# EAGLE schematic HighVoltageMeasurementModule_1000V_multimax (EAGLE 9.6.2)

## Sheet 1 of 2
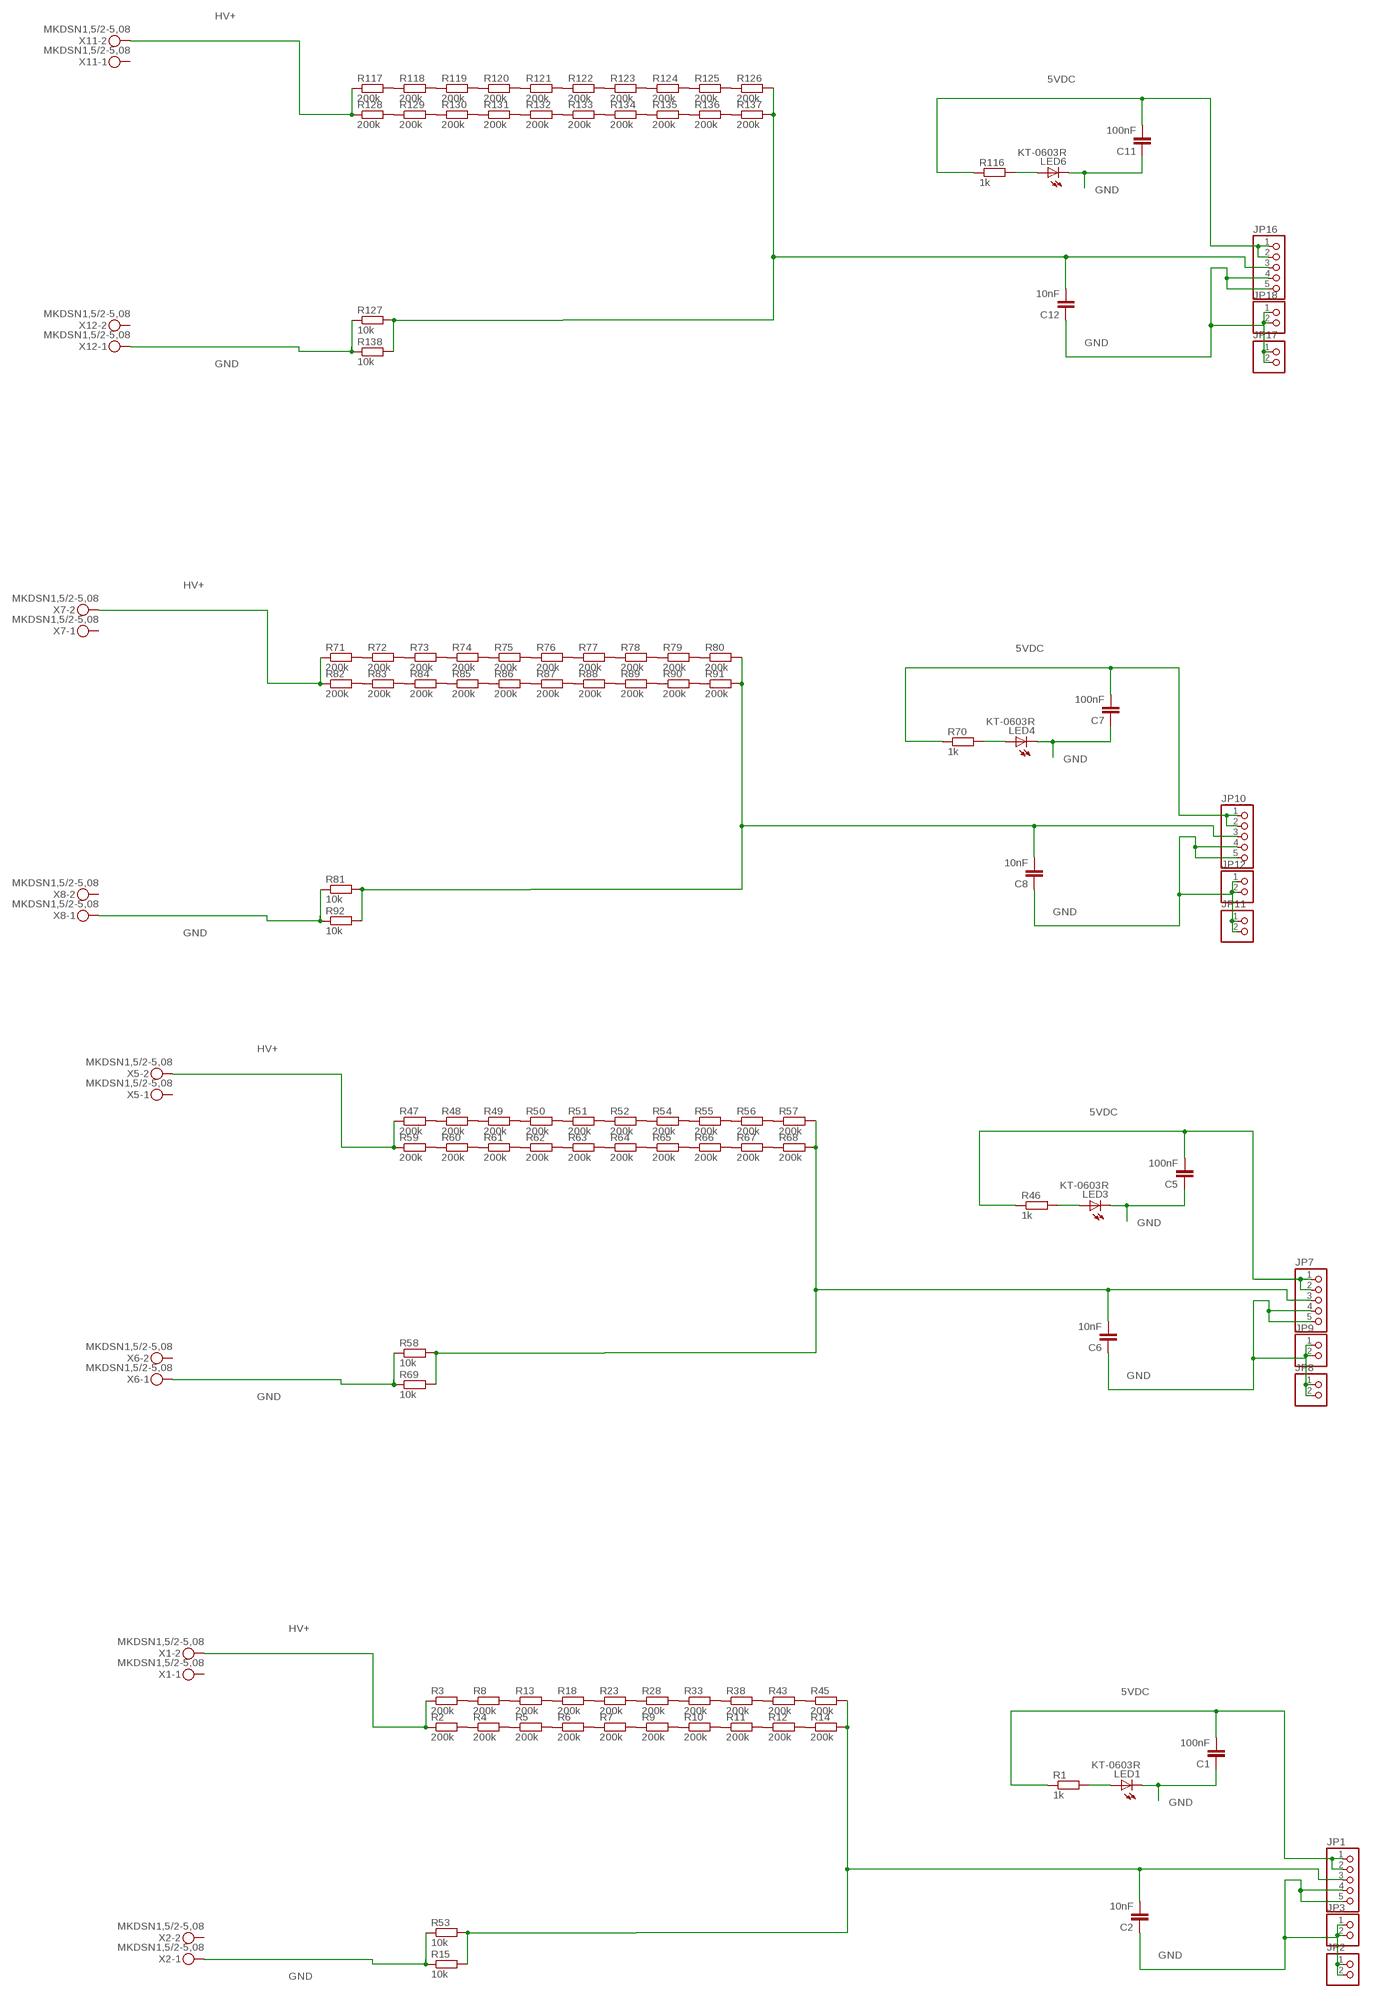
[diagram p0: schematic, sheet 1, part 1 of 3]
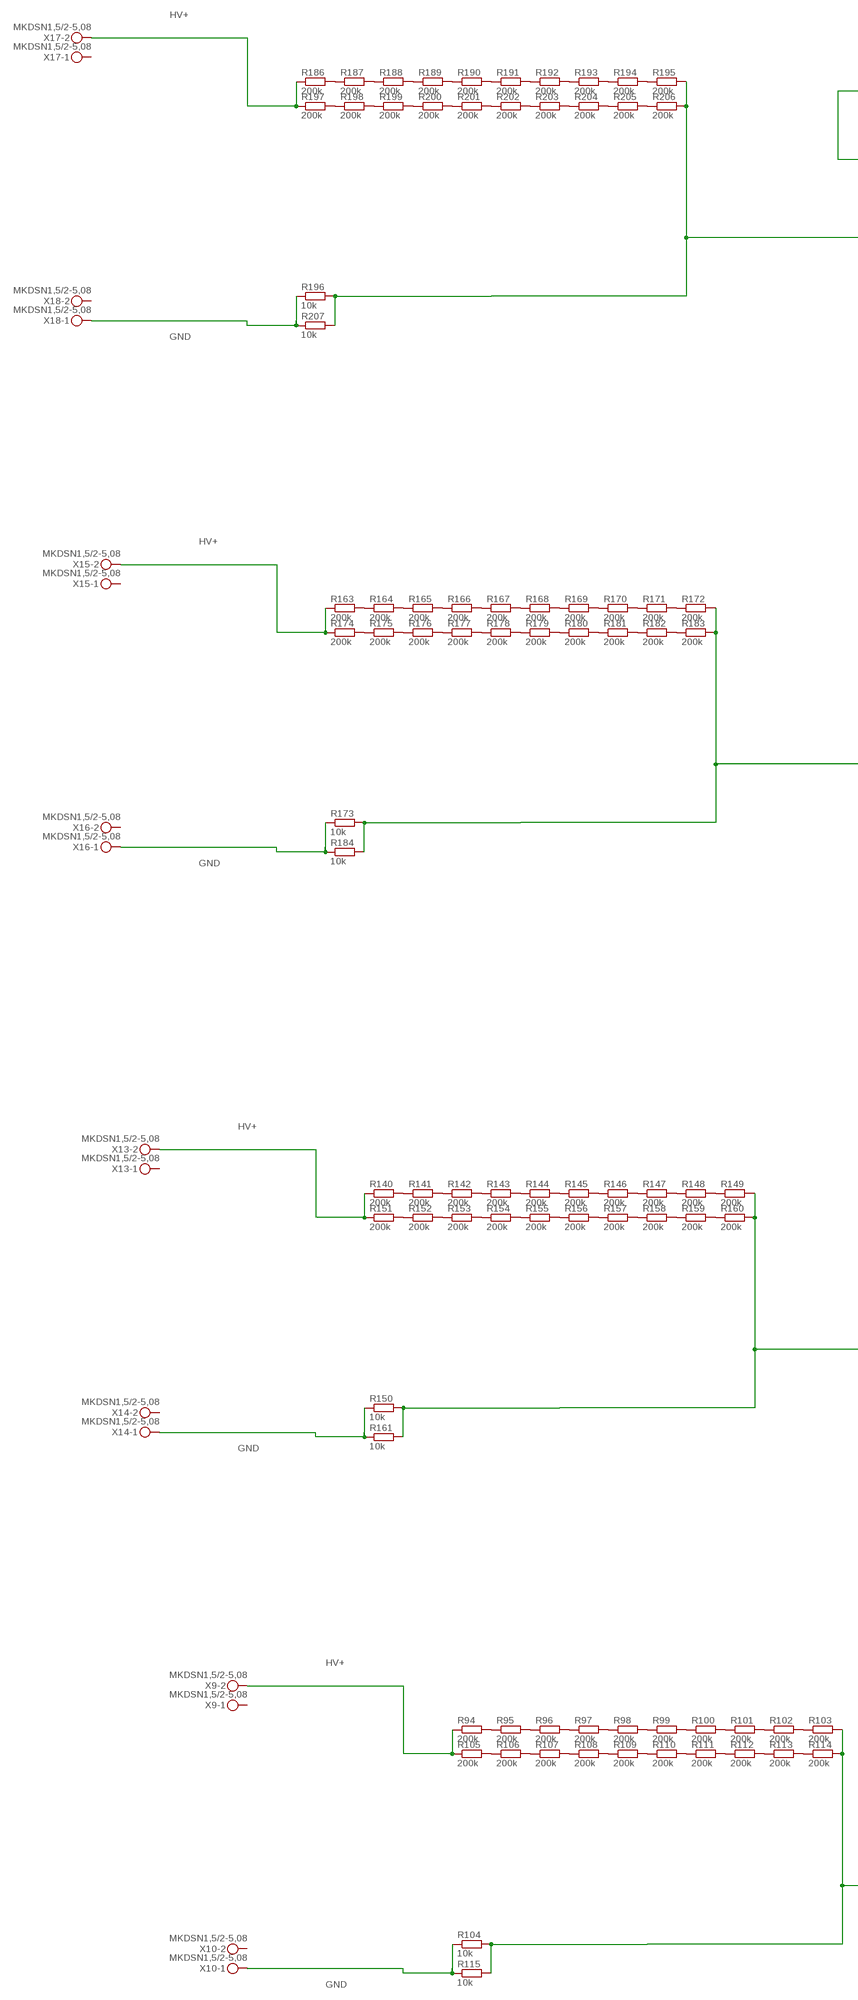
[diagram p1: schematic, sheet 1, part 2 of 3]
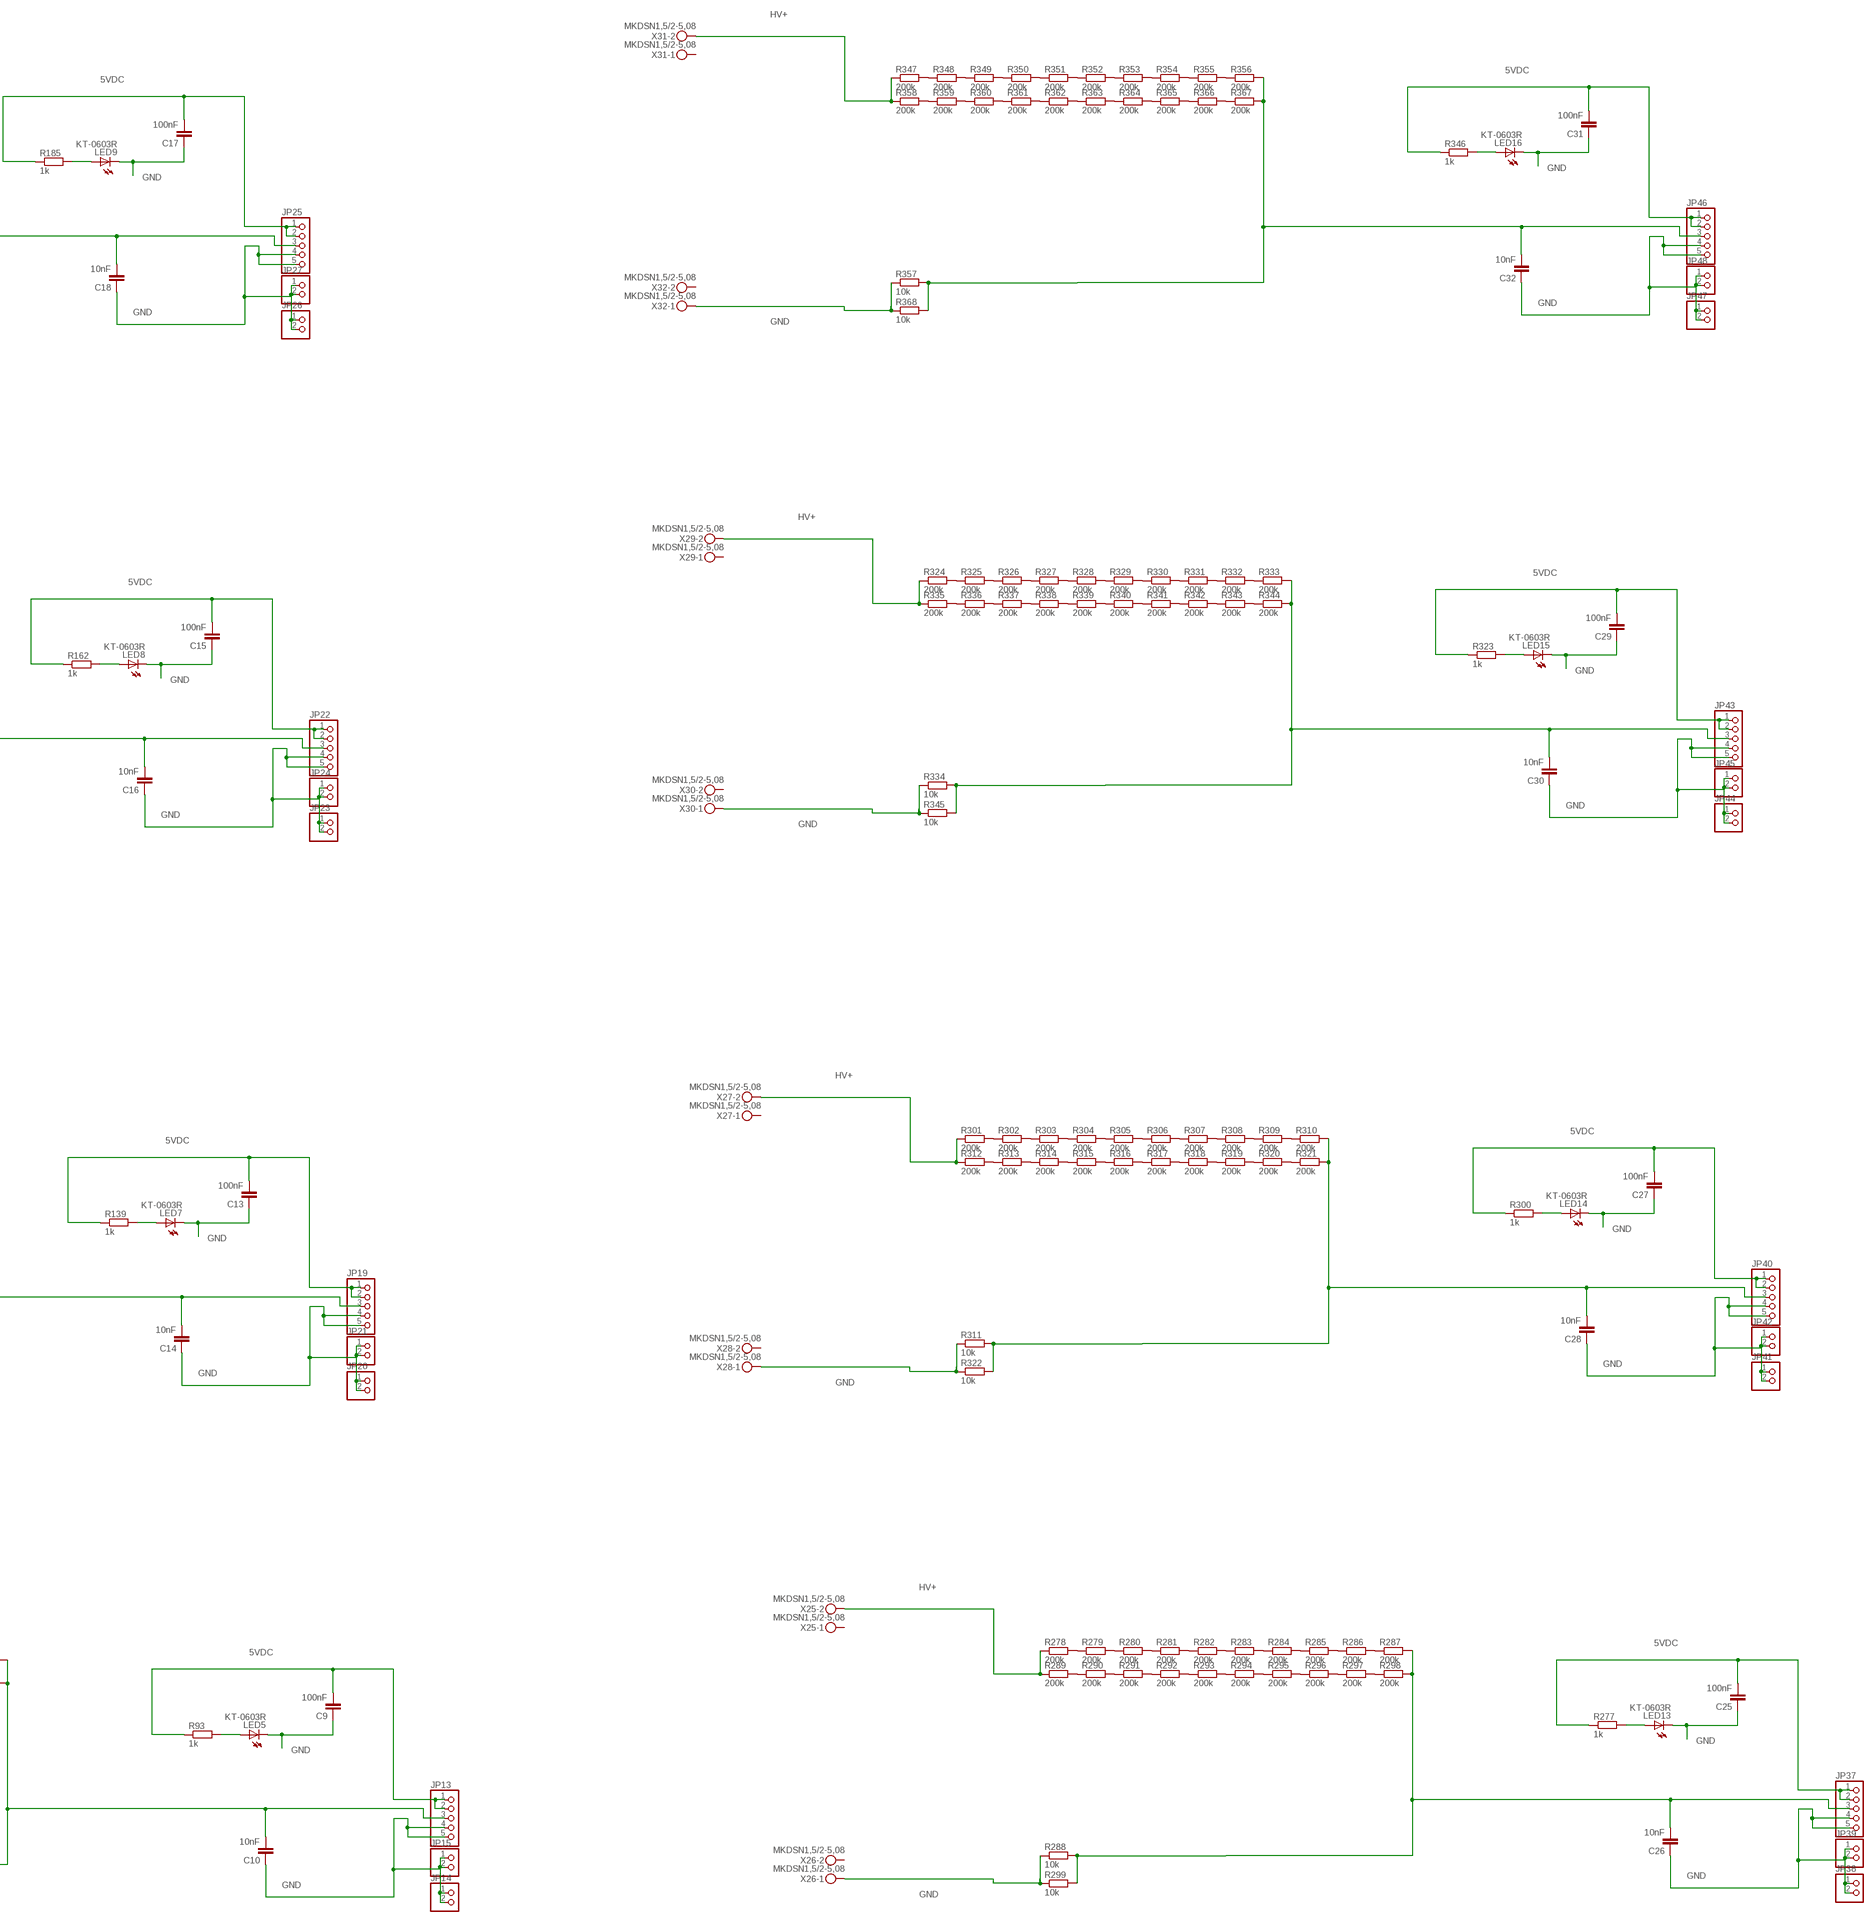
[diagram p2: schematic, sheet 1, part 3 of 3]

### Parts
C1  100nF  C-EUC0805  [C0805]
C2  10nF  C-EUC0805  [C0805]
C5  100nF  C-EUC0805  [C0805]
C6  10nF  C-EUC0805  [C0805]
C7  100nF  C-EUC0805  [C0805]
C8  10nF  C-EUC0805  [C0805]
C9  100nF  C-EUC0805  [C0805]
C10  10nF  C-EUC0805  [C0805]
C11  100nF  C-EUC0805  [C0805]
C12  10nF  C-EUC0805  [C0805]
C13  100nF  C-EUC0805  [C0805]
C14  10nF  C-EUC0805  [C0805]
C15  100nF  C-EUC0805  [C0805]
C16  10nF  C-EUC0805  [C0805]
C17  100nF  C-EUC0805  [C0805]
C18  10nF  C-EUC0805  [C0805]
C25  100nF  C-EUC0805  [C0805]
C26  10nF  C-EUC0805  [C0805]
C27  100nF  C-EUC0805  [C0805]
C28  10nF  C-EUC0805  [C0805]
C29  100nF  C-EUC0805  [C0805]
C30  10nF  C-EUC0805  [C0805]
C31  100nF  C-EUC0805  [C0805]
C32  10nF  C-EUC0805  [C0805]
JP1  PINHD-1X5  [1X05]
JP2  PINHD-1X2  [1X02]
JP3  PINHD-1X2  [1X02]
JP7  PINHD-1X5  [1X05]
JP8  PINHD-1X2  [1X02]
JP9  PINHD-1X2  [1X02]
JP10  PINHD-1X5  [1X05]
JP11  PINHD-1X2  [1X02]
JP12  PINHD-1X2  [1X02]
JP13  PINHD-1X5  [1X05]
JP14  PINHD-1X2  [1X02]
JP15  PINHD-1X2  [1X02]
JP16  PINHD-1X5  [1X05]
JP17  PINHD-1X2  [1X02]
JP18  PINHD-1X2  [1X02]
JP19  PINHD-1X5  [1X05]
JP20  PINHD-1X2  [1X02]
JP21  PINHD-1X2  [1X02]
JP22  PINHD-1X5  [1X05]
JP23  PINHD-1X2  [1X02]
JP24  PINHD-1X2  [1X02]
JP25  PINHD-1X5  [1X05]
JP26  PINHD-1X2  [1X02]
JP27  PINHD-1X2  [1X02]
JP37  PINHD-1X5  [1X05]
JP38  PINHD-1X2  [1X02]
JP39  PINHD-1X2  [1X02]
JP40  PINHD-1X5  [1X05]
JP41  PINHD-1X2  [1X02]
JP42  PINHD-1X2  [1X02]
JP43  PINHD-1X5  [1X05]
JP44  PINHD-1X2  [1X02]
JP45  PINHD-1X2  [1X02]
JP46  PINHD-1X5  [1X05]
JP47  PINHD-1X2  [1X02]
JP48  PINHD-1X2  [1X02]
LED1  KT-0603R  LEDCHIPLED_0603  [CHIPLED_0603]
LED3  KT-0603R  LEDCHIPLED_0603  [CHIPLED_0603]
LED4  KT-0603R  LEDCHIPLED_0603  [CHIPLED_0603]
LED5  KT-0603R  LEDCHIPLED_0603  [CHIPLED_0603]
LED6  KT-0603R  LEDCHIPLED_0603  [CHIPLED_0603]
LED7  KT-0603R  LEDCHIPLED_0603  [CHIPLED_0603]
LED8  KT-0603R  LEDCHIPLED_0603  [CHIPLED_0603]
LED9  KT-0603R  LEDCHIPLED_0603  [CHIPLED_0603]
LED13  KT-0603R  LEDCHIPLED_0603  [CHIPLED_0603]
LED14  KT-0603R  LEDCHIPLED_0603  [CHIPLED_0603]
LED15  KT-0603R  LEDCHIPLED_0603  [CHIPLED_0603]
LED16  KT-0603R  LEDCHIPLED_0603  [CHIPLED_0603]
R1  1k  R-EU_R0805  [R0805]
R2  200k  R-EU_R0805  [R0805]
R3  200k  R-EU_R0805  [R0805]
R4  200k  R-EU_R0805  [R0805]
R5  200k  R-EU_R0805  [R0805]
R6  200k  R-EU_R0805  [R0805]
R7  200k  R-EU_R0805  [R0805]
R8  200k  R-EU_R0805  [R0805]
R9  200k  R-EU_R0805  [R0805]
R10  200k  R-EU_R0805  [R0805]
R11  200k  R-EU_R0805  [R0805]
R12  200k  R-EU_R0805  [R0805]
R13  200k  R-EU_R0805  [R0805]
R14  200k  R-EU_R0805  [R0805]
R15  10k  R-EU_R0805  [R0805]
R18  200k  R-EU_R0805  [R0805]
R23  200k  R-EU_R0805  [R0805]
R28  200k  R-EU_R0805  [R0805]
R33  200k  R-EU_R0805  [R0805]
R38  200k  R-EU_R0805  [R0805]
R43  200k  R-EU_R0805  [R0805]
R45  200k  R-EU_R0805  [R0805]
R46  1k  R-EU_R0805  [R0805]
R47  200k  R-EU_R0805  [R0805]
R48  200k  R-EU_R0805  [R0805]
R49  200k  R-EU_R0805  [R0805]
R50  200k  R-EU_R0805  [R0805]
R51  200k  R-EU_R0805  [R0805]
R52  200k  R-EU_R0805  [R0805]
R53  10k  R-EU_R0805  [R0805]
R54  200k  R-EU_R0805  [R0805]
R55  200k  R-EU_R0805  [R0805]
R56  200k  R-EU_R0805  [R0805]
R57  200k  R-EU_R0805  [R0805]
R58  10k  R-EU_R0805  [R0805]
R59  200k  R-EU_R0805  [R0805]
R60  200k  R-EU_R0805  [R0805]
R61  200k  R-EU_R0805  [R0805]
R62  200k  R-EU_R0805  [R0805]
R63  200k  R-EU_R0805  [R0805]
R64  200k  R-EU_R0805  [R0805]
R65  200k  R-EU_R0805  [R0805]
R66  200k  R-EU_R0805  [R0805]
R67  200k  R-EU_R0805  [R0805]
R68  200k  R-EU_R0805  [R0805]
R69  10k  R-EU_R0805  [R0805]
R70  1k  R-EU_R0805  [R0805]
R71  200k  R-EU_R0805  [R0805]
R72  200k  R-EU_R0805  [R0805]
R73  200k  R-EU_R0805  [R0805]
R74  200k  R-EU_R0805  [R0805]
R75  200k  R-EU_R0805  [R0805]
R76  200k  R-EU_R0805  [R0805]
R77  200k  R-EU_R0805  [R0805]
R78  200k  R-EU_R0805  [R0805]
R79  200k  R-EU_R0805  [R0805]
R80  200k  R-EU_R0805  [R0805]
R81  10k  R-EU_R0805  [R0805]
R82  200k  R-EU_R0805  [R0805]
R83  200k  R-EU_R0805  [R0805]
R84  200k  R-EU_R0805  [R0805]
R85  200k  R-EU_R0805  [R0805]
R86  200k  R-EU_R0805  [R0805]
R87  200k  R-EU_R0805  [R0805]
R88  200k  R-EU_R0805  [R0805]
R89  200k  R-EU_R0805  [R0805]
R90  200k  R-EU_R0805  [R0805]
R91  200k  R-EU_R0805  [R0805]
R92  10k  R-EU_R0805  [R0805]
R93  1k  R-EU_R0805  [R0805]
R94  200k  R-EU_R0805  [R0805]
R95  200k  R-EU_R0805  [R0805]
R96  200k  R-EU_R0805  [R0805]
R97  200k  R-EU_R0805  [R0805]
R98  200k  R-EU_R0805  [R0805]
R99  200k  R-EU_R0805  [R0805]
R100  200k  R-EU_R0805  [R0805]
R101  200k  R-EU_R0805  [R0805]
R102  200k  R-EU_R0805  [R0805]
R103  200k  R-EU_R0805  [R0805]
R104  10k  R-EU_R0805  [R0805]
R105  200k  R-EU_R0805  [R0805]
R106  200k  R-EU_R0805  [R0805]
R107  200k  R-EU_R0805  [R0805]
R108  200k  R-EU_R0805  [R0805]
R109  200k  R-EU_R0805  [R0805]
R110  200k  R-EU_R0805  [R0805]
R111  200k  R-EU_R0805  [R0805]
R112  200k  R-EU_R0805  [R0805]
R113  200k  R-EU_R0805  [R0805]
R114  200k  R-EU_R0805  [R0805]
R115  10k  R-EU_R0805  [R0805]
R116  1k  R-EU_R0805  [R0805]
R117  200k  R-EU_R0805  [R0805]
R118  200k  R-EU_R0805  [R0805]
R119  200k  R-EU_R0805  [R0805]
R120  200k  R-EU_R0805  [R0805]
R121  200k  R-EU_R0805  [R0805]
R122  200k  R-EU_R0805  [R0805]
R123  200k  R-EU_R0805  [R0805]
R124  200k  R-EU_R0805  [R0805]
R125  200k  R-EU_R0805  [R0805]
R126  200k  R-EU_R0805  [R0805]
R127  10k  R-EU_R0805  [R0805]
R128  200k  R-EU_R0805  [R0805]
R129  200k  R-EU_R0805  [R0805]
R130  200k  R-EU_R0805  [R0805]
R131  200k  R-EU_R0805  [R0805]
R132  200k  R-EU_R0805  [R0805]
R133  200k  R-EU_R0805  [R0805]
R134  200k  R-EU_R0805  [R0805]
R135  200k  R-EU_R0805  [R0805]
R136  200k  R-EU_R0805  [R0805]
R137  200k  R-EU_R0805  [R0805]
R138  10k  R-EU_R0805  [R0805]
R139  1k  R-EU_R0805  [R0805]
R140  200k  R-EU_R0805  [R0805]
R141  200k  R-EU_R0805  [R0805]
R142  200k  R-EU_R0805  [R0805]
R143  200k  R-EU_R0805  [R0805]
R144  200k  R-EU_R0805  [R0805]
R145  200k  R-EU_R0805  [R0805]
R146  200k  R-EU_R0805  [R0805]
R147  200k  R-EU_R0805  [R0805]
R148  200k  R-EU_R0805  [R0805]
R149  200k  R-EU_R0805  [R0805]
R150  10k  R-EU_R0805  [R0805]
R151  200k  R-EU_R0805  [R0805]
R152  200k  R-EU_R0805  [R0805]
R153  200k  R-EU_R0805  [R0805]
R154  200k  R-EU_R0805  [R0805]
R155  200k  R-EU_R0805  [R0805]
R156  200k  R-EU_R0805  [R0805]
R157  200k  R-EU_R0805  [R0805]
R158  200k  R-EU_R0805  [R0805]
R159  200k  R-EU_R0805  [R0805]
R160  200k  R-EU_R0805  [R0805]
R161  10k  R-EU_R0805  [R0805]
R162  1k  R-EU_R0805  [R0805]
R163  200k  R-EU_R0805  [R0805]
R164  200k  R-EU_R0805  [R0805]
R165  200k  R-EU_R0805  [R0805]
R166  200k  R-EU_R0805  [R0805]
R167  200k  R-EU_R0805  [R0805]
R168  200k  R-EU_R0805  [R0805]
R169  200k  R-EU_R0805  [R0805]
R170  200k  R-EU_R0805  [R0805]
R171  200k  R-EU_R0805  [R0805]
R172  200k  R-EU_R0805  [R0805]
R173  10k  R-EU_R0805  [R0805]
R174  200k  R-EU_R0805  [R0805]
R175  200k  R-EU_R0805  [R0805]
R176  200k  R-EU_R0805  [R0805]
R177  200k  R-EU_R0805  [R0805]
R178  200k  R-EU_R0805  [R0805]
R179  200k  R-EU_R0805  [R0805]
R180  200k  R-EU_R0805  [R0805]
R181  200k  R-EU_R0805  [R0805]
R182  200k  R-EU_R0805  [R0805]
R183  200k  R-EU_R0805  [R0805]
R184  10k  R-EU_R0805  [R0805]
R185  1k  R-EU_R0805  [R0805]
R186  200k  R-EU_R0805  [R0805]
R187  200k  R-EU_R0805  [R0805]
R188  200k  R-EU_R0805  [R0805]
R189  200k  R-EU_R0805  [R0805]
R190  200k  R-EU_R0805  [R0805]
R191  200k  R-EU_R0805  [R0805]
R192  200k  R-EU_R0805  [R0805]
R193  200k  R-EU_R0805  [R0805]
R194  200k  R-EU_R0805  [R0805]
R195  200k  R-EU_R0805  [R0805]
R196  10k  R-EU_R0805  [R0805]
R197  200k  R-EU_R0805  [R0805]
R198  200k  R-EU_R0805  [R0805]
R199  200k  R-EU_R0805  [R0805]
R200  200k  R-EU_R0805  [R0805]
R201  200k  R-EU_R0805  [R0805]
R202  200k  R-EU_R0805  [R0805]
R203  200k  R-EU_R0805  [R0805]
R204  200k  R-EU_R0805  [R0805]
R205  200k  R-EU_R0805  [R0805]
R206  200k  R-EU_R0805  [R0805]
R207  10k  R-EU_R0805  [R0805]
R277  1k  R-EU_R0805  [R0805]
R278  200k  R-EU_R0805  [R0805]
R279  200k  R-EU_R0805  [R0805]
R280  200k  R-EU_R0805  [R0805]
R281  200k  R-EU_R0805  [R0805]
R282  200k  R-EU_R0805  [R0805]
R283  200k  R-EU_R0805  [R0805]
R284  200k  R-EU_R0805  [R0805]
R285  200k  R-EU_R0805  [R0805]
R286  200k  R-EU_R0805  [R0805]
R287  200k  R-EU_R0805  [R0805]
R288  10k  R-EU_R0805  [R0805]
R289  200k  R-EU_R0805  [R0805]
R290  200k  R-EU_R0805  [R0805]
R291  200k  R-EU_R0805  [R0805]
R292  200k  R-EU_R0805  [R0805]
R293  200k  R-EU_R0805  [R0805]
R294  200k  R-EU_R0805  [R0805]
R295  200k  R-EU_R0805  [R0805]
R296  200k  R-EU_R0805  [R0805]
R297  200k  R-EU_R0805  [R0805]
R298  200k  R-EU_R0805  [R0805]
R299  10k  R-EU_R0805  [R0805]
R300  1k  R-EU_R0805  [R0805]
R301  200k  R-EU_R0805  [R0805]
R302  200k  R-EU_R0805  [R0805]
R303  200k  R-EU_R0805  [R0805]
R304  200k  R-EU_R0805  [R0805]
R305  200k  R-EU_R0805  [R0805]
R306  200k  R-EU_R0805  [R0805]
R307  200k  R-EU_R0805  [R0805]
R308  200k  R-EU_R0805  [R0805]
R309  200k  R-EU_R0805  [R0805]
R310  200k  R-EU_R0805  [R0805]
R311  10k  R-EU_R0805  [R0805]
R312  200k  R-EU_R0805  [R0805]
R313  200k  R-EU_R0805  [R0805]
R314  200k  R-EU_R0805  [R0805]
R315  200k  R-EU_R0805  [R0805]
R316  200k  R-EU_R0805  [R0805]
R317  200k  R-EU_R0805  [R0805]
R318  200k  R-EU_R0805  [R0805]
R319  200k  R-EU_R0805  [R0805]
R320  200k  R-EU_R0805  [R0805]
R321  200k  R-EU_R0805  [R0805]
R322  10k  R-EU_R0805  [R0805]
R323  1k  R-EU_R0805  [R0805]
R324  200k  R-EU_R0805  [R0805]
R325  200k  R-EU_R0805  [R0805]
R326  200k  R-EU_R0805  [R0805]
R327  200k  R-EU_R0805  [R0805]
R328  200k  R-EU_R0805  [R0805]
R329  200k  R-EU_R0805  [R0805]
R330  200k  R-EU_R0805  [R0805]
R331  200k  R-EU_R0805  [R0805]
R332  200k  R-EU_R0805  [R0805]
R333  200k  R-EU_R0805  [R0805]
R334  10k  R-EU_R0805  [R0805]
R335  200k  R-EU_R0805  [R0805]
R336  200k  R-EU_R0805  [R0805]
R337  200k  R-EU_R0805  [R0805]
R338  200k  R-EU_R0805  [R0805]
R339  200k  R-EU_R0805  [R0805]
R340  200k  R-EU_R0805  [R0805]
R341  200k  R-EU_R0805  [R0805]
R342  200k  R-EU_R0805  [R0805]
R343  200k  R-EU_R0805  [R0805]
R344  200k  R-EU_R0805  [R0805]
R345  10k  R-EU_R0805  [R0805]
R346  1k  R-EU_R0805  [R0805]
R347  200k  R-EU_R0805  [R0805]
R348  200k  R-EU_R0805  [R0805]
R349  200k  R-EU_R0805  [R0805]
R350  200k  R-EU_R0805  [R0805]
R351  200k  R-EU_R0805  [R0805]
R352  200k  R-EU_R0805  [R0805]
R353  200k  R-EU_R0805  [R0805]
R354  200k  R-EU_R0805  [R0805]
R355  200k  R-EU_R0805  [R0805]
R356  200k  R-EU_R0805  [R0805]
R357  10k  R-EU_R0805  [R0805]
R358  200k  R-EU_R0805  [R0805]
R359  200k  R-EU_R0805  [R0805]
R360  200k  R-EU_R0805  [R0805]
R361  200k  R-EU_R0805  [R0805]
R362  200k  R-EU_R0805  [R0805]
R363  200k  R-EU_R0805  [R0805]
R364  200k  R-EU_R0805  [R0805]
R365  200k  R-EU_R0805  [R0805]
R366  200k  R-EU_R0805  [R0805]
R367  200k  R-EU_R0805  [R0805]
R368  10k  R-EU_R0805  [R0805]
X1  MKDSN1,5/2-5,08  [MKDSN1,5/2-5,08]
X2  MKDSN1,5/2-5,08  [MKDSN1,5/2-5,08]
X5  MKDSN1,5/2-5,08  [MKDSN1,5/2-5,08]
X6  MKDSN1,5/2-5,08  [MKDSN1,5/2-5,08]
X7  MKDSN1,5/2-5,08  [MKDSN1,5/2-5,08]
X8  MKDSN1,5/2-5,08  [MKDSN1,5/2-5,08]
X9  MKDSN1,5/2-5,08  [MKDSN1,5/2-5,08]
X10  MKDSN1,5/2-5,08  [MKDSN1,5/2-5,08]
X11  MKDSN1,5/2-5,08  [MKDSN1,5/2-5,08]
X12  MKDSN1,5/2-5,08  [MKDSN1,5/2-5,08]
X13  MKDSN1,5/2-5,08  [MKDSN1,5/2-5,08]
X14  MKDSN1,5/2-5,08  [MKDSN1,5/2-5,08]
X15  MKDSN1,5/2-5,08  [MKDSN1,5/2-5,08]
X16  MKDSN1,5/2-5,08  [MKDSN1,5/2-5,08]
X17  MKDSN1,5/2-5,08  [MKDSN1,5/2-5,08]
X18  MKDSN1,5/2-5,08  [MKDSN1,5/2-5,08]
X25  MKDSN1,5/2-5,08  [MKDSN1,5/2-5,08]
X26  MKDSN1,5/2-5,08  [MKDSN1,5/2-5,08]
X27  MKDSN1,5/2-5,08  [MKDSN1,5/2-5,08]
X28  MKDSN1,5/2-5,08  [MKDSN1,5/2-5,08]
X29  MKDSN1,5/2-5,08  [MKDSN1,5/2-5,08]
X30  MKDSN1,5/2-5,08  [MKDSN1,5/2-5,08]
X31  MKDSN1,5/2-5,08  [MKDSN1,5/2-5,08]
X32  MKDSN1,5/2-5,08  [MKDSN1,5/2-5,08]

### Nets
5VDC: C1.2 C5.2 C7.2 C9.2 C11.2 C13.2 C15.2 C17.2 C25.2 C27.2 C29.2 C31.2 JP1.1 JP1.2 JP7.1 JP7.2 JP10.1 JP10.2 JP13.1 JP13.2 JP16.1 JP16.2 JP19.1 JP19.2 JP22.1 JP22.2 JP25.1 JP25.2 JP37.1 JP37.2 JP40.1 JP40.2 JP43.1 JP43.2 JP46.1 JP46.2 R1.1 R46.1 R70.1 R93.1 R116.1 R139.1 R162.1 R185.1 R277.1 R300.1 R323.1 R346.1
GND: C1.1 C2.1 C5.1 C6.1 C7.1 C8.1 C9.1 C10.1 C11.1 C12.1 C13.1 C14.1 C15.1 C16.1 C17.1 C18.1 C25.1 C26.1 C27.1 C28.1 C29.1 C30.1 C31.1 C32.1 JP1.4 JP1.5 JP2.1 JP2.2 JP3.1 JP3.2 JP7.4 JP7.5 JP8.1 JP8.2 JP9.1 JP9.2 JP10.4 JP10.5 JP11.1 JP11.2 JP12.1 JP12.2 JP13.4 JP13.5 JP14.1 JP14.2 JP15.1 JP15.2 JP16.4 JP16.5 JP17.1 JP17.2 JP18.1 JP18.2 JP19.4 JP19.5 JP20.1 JP20.2 JP21.1 JP21.2 JP22.4 JP22.5 JP23.1 JP23.2 JP24.1 JP24.2 JP25.4 JP25.5 JP26.1 JP26.2 JP27.1 JP27.2 JP37.4 JP37.5 JP38.1 JP38.2 JP39.1 JP39.2 JP40.4 JP40.5 JP41.1 JP41.2 JP42.1 JP42.2 JP43.4 JP43.5 JP44.1 JP44.2 JP45.1 JP45.2 JP46.4 JP46.5 JP47.1 JP47.2 JP48.1 JP48.2 LED1.C LED3.C LED4.C LED5.C LED6.C LED7.C LED8.C LED9.C LED13.C LED14.C LED15.C LED16.C R15.1 R53.1 R58.1 R69.1 R81.1 R92.1 R104.1 R115.1 R127.1 R138.1 R150.1 R161.1 R173.1 R184.1 R196.1 R207.1 R288.1 R299.1 R311.1 R322.1 R334.1 R345.1 R357.1 R368.1 X2.1 X6.1 X8.1 X10.1 X12.1 X14.1 X16.1 X18.1 X26.1 X28.1 X30.1 X32.1
HV+: R2.1 R3.1 R47.1 R59.1 R71.1 R82.1 R94.1 R105.1 R117.1 R128.1 R140.1 R151.1 R163.1 R174.1 R186.1 R197.1 R278.1 R289.1 R301.1 R312.1 R324.1 R335.1 R347.1 R358.1 X1.2 X5.2 X7.2 X9.2 X11.2 X13.2 X15.2 X17.2 X25.2 X27.2 X29.2 X31.2
N$1: R2.2 R4.1
N$2: R4.2 R5.1
N$3: R5.2 R6.1
N$4: R6.2 R7.1
N$5: LED1.A R1.2
N$7: R7.2 R9.1
N$8: R3.2 R8.1
N$9: R8.2 R13.1
N$10: R9.2 R10.1
N$11: R10.2 R11.1
N$12: R11.2 R12.1
N$13: R12.2 R14.1
N$14: R13.2 R18.1
N$15: C2.2 JP1.3 R14.2 R15.2 R45.2 R53.2
N$19: R18.2 R23.1
N$24: R23.2 R28.1
N$29: R28.2 R33.1
N$34: R33.2 R38.1
N$39: R38.2 R43.1
N$40: LED3.A R46.2
N$41: R43.2 R45.1
N$42: R47.2 R48.1
N$43: R48.2 R49.1
N$44: R49.2 R50.1
N$45: R50.2 R51.1
N$46: R51.2 R52.1
N$47: R52.2 R54.1
N$48: R54.2 R55.1
N$49: R55.2 R56.1
N$50: R56.2 R57.1
N$51: R59.2 R60.1
N$52: R60.2 R61.1
N$53: R61.2 R62.1
N$54: R62.2 R63.1
N$55: R63.2 R64.1
N$56: R64.2 R65.1
N$57: R65.2 R66.1
N$58: R66.2 R67.1
N$59: R67.2 R68.1
N$60: C6.2 JP7.3 R57.2 R58.2 R68.2 R69.2
N$61: LED4.A R70.2
N$62: R71.2 R72.1
N$63: R72.2 R73.1
N$64: R73.2 R74.1
N$65: R74.2 R75.1
N$66: R75.2 R76.1
N$67: R76.2 R77.1
N$68: R77.2 R78.1
N$69: R78.2 R79.1
N$70: R79.2 R80.1
N$71: R82.2 R83.1
N$72: R83.2 R84.1
N$73: R84.2 R85.1
N$74: R85.2 R86.1
N$75: R86.2 R87.1
N$76: R87.2 R88.1
N$77: R88.2 R89.1
N$78: R89.2 R90.1
N$79: R90.2 R91.1
N$80: C8.2 JP10.3 R80.2 R81.2 R91.2 R92.2
N$81: LED5.A R93.2
N$82: R94.2 R95.1
N$83: R95.2 R96.1
N$84: R96.2 R97.1
N$85: R97.2 R98.1
N$86: R98.2 R99.1
N$87: R99.2 R100.1
N$88: R100.2 R101.1
N$89: R101.2 R102.1
N$90: R102.2 R103.1
N$91: R105.2 R106.1
N$92: R106.2 R107.1
N$93: R107.2 R108.1
N$94: R108.2 R109.1
N$95: R109.2 R110.1
N$96: R110.2 R111.1
N$97: R111.2 R112.1
N$98: R112.2 R113.1
N$99: R113.2 R114.1
N$100: C10.2 JP13.3 R103.2 R104.2 R114.2 R115.2
N$101: LED6.A R116.2
N$102: R117.2 R118.1
N$103: R118.2 R119.1
N$104: R119.2 R120.1
N$105: R120.2 R121.1
N$106: R121.2 R122.1
N$107: R122.2 R123.1
N$108: R123.2 R124.1
N$109: R124.2 R125.1
N$110: R125.2 R126.1
N$111: R128.2 R129.1
N$112: R129.2 R130.1
N$113: R130.2 R131.1
N$114: R131.2 R132.1
N$115: R132.2 R133.1
N$116: R133.2 R134.1
N$117: R134.2 R135.1
N$118: R135.2 R136.1
N$119: R136.2 R137.1
N$120: C12.2 JP16.3 R126.2 R127.2 R137.2 R138.2
N$121: LED7.A R139.2
N$122: R140.2 R141.1
N$123: R141.2 R142.1
N$124: R142.2 R143.1
N$125: R143.2 R144.1
N$126: R144.2 R145.1
N$127: R145.2 R146.1
N$128: R146.2 R147.1
N$129: R147.2 R148.1
N$130: R148.2 R149.1
N$131: R151.2 R152.1
N$132: R152.2 R153.1
N$133: R153.2 R154.1
N$134: R154.2 R155.1
N$135: R155.2 R156.1
N$136: R156.2 R157.1
N$137: R157.2 R158.1
N$138: R158.2 R159.1
N$139: R159.2 R160.1
N$140: C14.2 JP19.3 R149.2 R150.2 R160.2 R161.2
N$141: LED8.A R162.2
N$142: R163.2 R164.1
N$143: R164.2 R165.1
N$144: R165.2 R166.1
N$145: R166.2 R167.1
N$146: R167.2 R168.1
N$147: R168.2 R169.1
N$148: R169.2 R170.1
N$149: R170.2 R171.1
N$150: R171.2 R172.1
N$151: R174.2 R175.1
N$152: R175.2 R176.1
N$153: R176.2 R177.1
N$154: R177.2 R178.1
N$155: R178.2 R179.1
N$156: R179.2 R180.1
N$157: R180.2 R181.1
N$158: R181.2 R182.1
N$159: R182.2 R183.1
N$160: C16.2 JP22.3 R172.2 R173.2 R183.2 R184.2
N$161: LED9.A R185.2
N$162: R186.2 R187.1
N$163: R187.2 R188.1
N$164: R188.2 R189.1
N$165: R189.2 R190.1
N$166: R190.2 R191.1
N$167: R191.2 R192.1
N$168: R192.2 R193.1
N$169: R193.2 R194.1
N$170: R194.2 R195.1
N$171: R197.2 R198.1
N$172: R198.2 R199.1
N$173: R199.2 R200.1
N$174: R200.2 R201.1
N$175: R201.2 R202.1
N$176: R202.2 R203.1
N$177: R203.2 R204.1
N$178: R204.2 R205.1
N$179: R205.2 R206.1
N$180: C18.2 JP25.3 R195.2 R196.2 R206.2 R207.2
N$241: LED13.A R277.2
N$242: R278.2 R279.1
N$243: R279.2 R280.1
N$244: R280.2 R281.1
N$245: R281.2 R282.1
N$246: R282.2 R283.1
N$247: R283.2 R284.1
N$248: R284.2 R285.1
N$249: R285.2 R286.1
N$250: R286.2 R287.1
N$251: R289.2 R290.1
N$252: R290.2 R291.1
N$253: R291.2 R292.1
N$254: R292.2 R293.1
N$255: R293.2 R294.1
N$256: R294.2 R295.1
N$257: R295.2 R296.1
N$258: R296.2 R297.1
N$259: R297.2 R298.1
N$260: C26.2 JP37.3 R287.2 R288.2 R298.2 R299.2
N$261: LED14.A R300.2
N$262: R301.2 R302.1
N$263: R302.2 R303.1
N$264: R303.2 R304.1
N$265: R304.2 R305.1
N$266: R305.2 R306.1
N$267: R306.2 R307.1
N$268: R307.2 R308.1
N$269: R308.2 R309.1
N$270: R309.2 R310.1
N$271: R312.2 R313.1
N$272: R313.2 R314.1
N$273: R314.2 R315.1
N$274: R315.2 R316.1
N$275: R316.2 R317.1
N$276: R317.2 R318.1
N$277: R318.2 R319.1
N$278: R319.2 R320.1
N$279: R320.2 R321.1
N$280: C28.2 JP40.3 R310.2 R311.2 R321.2 R322.2
N$281: LED15.A R323.2
N$282: R324.2 R325.1
N$283: R325.2 R326.1
N$284: R326.2 R327.1
N$285: R327.2 R328.1
N$286: R328.2 R329.1
N$287: R329.2 R330.1
N$288: R330.2 R331.1
N$289: R331.2 R332.1
N$290: R332.2 R333.1
N$291: R335.2 R336.1
N$292: R336.2 R337.1
N$293: R337.2 R338.1
N$294: R338.2 R339.1
N$295: R339.2 R340.1
N$296: R340.2 R341.1
N$297: R341.2 R342.1
N$298: R342.2 R343.1
N$299: R343.2 R344.1
N$300: C30.2 JP43.3 R333.2 R334.2 R344.2 R345.2
N$301: LED16.A R346.2
N$302: R347.2 R348.1
N$303: R348.2 R349.1
N$304: R349.2 R350.1
N$305: R350.2 R351.1
N$306: R351.2 R352.1
N$307: R352.2 R353.1
N$308: R353.2 R354.1
N$309: R354.2 R355.1
N$310: R355.2 R356.1
N$311: R358.2 R359.1
N$312: R359.2 R360.1
N$313: R360.2 R361.1
N$314: R361.2 R362.1
N$315: R362.2 R363.1
N$316: R363.2 R364.1
N$317: R364.2 R365.1
N$318: R365.2 R366.1
N$319: R366.2 R367.1
N$320: C32.2 JP46.3 R356.2 R357.2 R367.2 R368.2
Unconnected: X1.1 X2.2 X5.1 X6.2 X7.1 X8.2 X9.1 X10.2 X11.1 X12.2 X13.1 X14.2 X15.1 X16.2 X17.1 X18.2 X25.1 X26.2 X27.1 X28.2 X29.1 X30.2 X31.1 X32.2

## Sheet 2 of 2

## Library data of the parts
C1 C2 C5-C18 C25-C32 = rcl:C-EU: CAPACITOR, European symbol
JP1 JP7 JP10 JP13 JP16 JP19 JP22 JP25 JP37 JP40 JP43 JP46 = pinhead:PINHD-1X5: PIN HEADER
JP2 JP3 JP8 JP9 JP11 JP12 JP14 JP15 JP17 JP18 JP20 JP21 JP23 JP24 JP26 JP27 JP38 JP39 JP41 JP42 JP44 JP45 JP47 JP48 = pinhead:PINHD-1X2: PIN HEADER
LED1 LED3-LED9 LED13-LED16 = led:LED: LED OSRAM: - CHIPLED LG R971, LG N971, LY N971, LG Q971, LY Q971, LO R971, LY R971 LH N974, LH R974 LS Q976, LO Q976, LY Q976 LO Q996 - Hyper CHIPLED LW Q18S LB Q993, LB Q99A, LB R99A - SideLED LS A670, LO A670, LY A670, LG A670, LP A670 LB A673, LV A673, LT A673, LW A673 LH A674 LY A675 LS A676, LA A676, LO A676, LY A676, LW A676 LS A679, LY A679, LG A679 - Hyper Micro SIDELED® LS Y876, LA Y876, LO Y876, LY Y876 LT Y87S - SmartLED LW L88C, LW L88S LB L89C, LB L89S, LG L890 LS L89K, LO L89K, LY L89K LS L896, LA L896, LO L896, LY L896 - TOPLED LS T670, LO T670, LY T670, LG T670, LP T670 LSG T670, LSP T670, LSY T670, LOP T670, LYG T670 LG T671, LOG T671, LSG T671 LB T673, LV T673, LT T673, LW T673 LH T674 LS T676, LA T676, LO T676, LY T676, LB T676, LH T676, LSB T676, LW T676 LB T67C, LV T67C, LT T67C, LS T67K, LO T67K, LY T67K, LW E67C LS E67B, LA E67B, LO E67B, LY E67B, LB E67C, LV E67C, LT E67C LW T67C LS T679, LY T679, LG T679 LS T770, LO T770, LY T770, LG T770, LP T770 LB T773, LV T773, LT T773, LW T773 LH T774 LS E675, LA E675, LY E675, LS T675 LS T776, LA T776, LO T776, LY T776, LB T776 LHGB T686 LT T68C, LB T68C - Hyper Mini TOPLED® LB M676 - Mini TOPLED Santana® LG M470 LS M47K, LO M47K, LY M47K Source: http://www.osram.convergy.de LUXEON: - LUMILED® LXK2-PW12-R00, LXK2-PW12-S00, LXK2-PW14-U00, LXK2-PW14-V00 LXK2-PM12-R00, LXK2-PM12-S00, LXK2-PM14-U00 LXK2-PE12-Q00, LXK2-PE12-R00, LXK2-PE12-S00, LXK2-PE14-T00, LXK2-PE14-U00 LXK2-PB12-K00, LXK2-PB12-L00, LXK2-PB12-M00, LXK2-PB14-N00, LXK2-PB14-P00, LXK2-PB14-Q00 LXK2-PR12-L00, LXK2-PR12-M00, LXK2-PR14-Q00, LXK2-PR14-R00 LXK2-PD12-Q00, LXK2-PD12-R00, LXK2-PD12-S00 LXK2-PH12-R00, LXK2-PH12-S00 LXK2-PL12-P00, LXK2-PL12-Q00, LXK2-PL12-R00 Source: www.luxeon.com KINGBRIGHT: KA-3528ASYC Source: www.kingbright.com
R1-R15 R18 R23 R28 R33 R38 R43 R45-R207 R277-R368 = rcl:R-EU_: RESISTOR, European symbol
X1 X2 X5-X18 X25-X32 = con-phoenix-508:MKDSN1,5/2-5,08: MKDSN 1,5/ 2-5,08 Printklemme Nennstrom: 13,5 A Nennspannung: 250 V Rastermaß: 5,08 mm Polzahl: 2 Anschlussart: Schraubanschluss Montage: Löten Anschlussrichtung Leiter/Platine: 0 ° Artikelnummer: 1729128 Source: http://eshop.phoenixcontact.com .. 1729128.pdf